# EAGLE design VIC_proto (EAGLE 7.7.0)
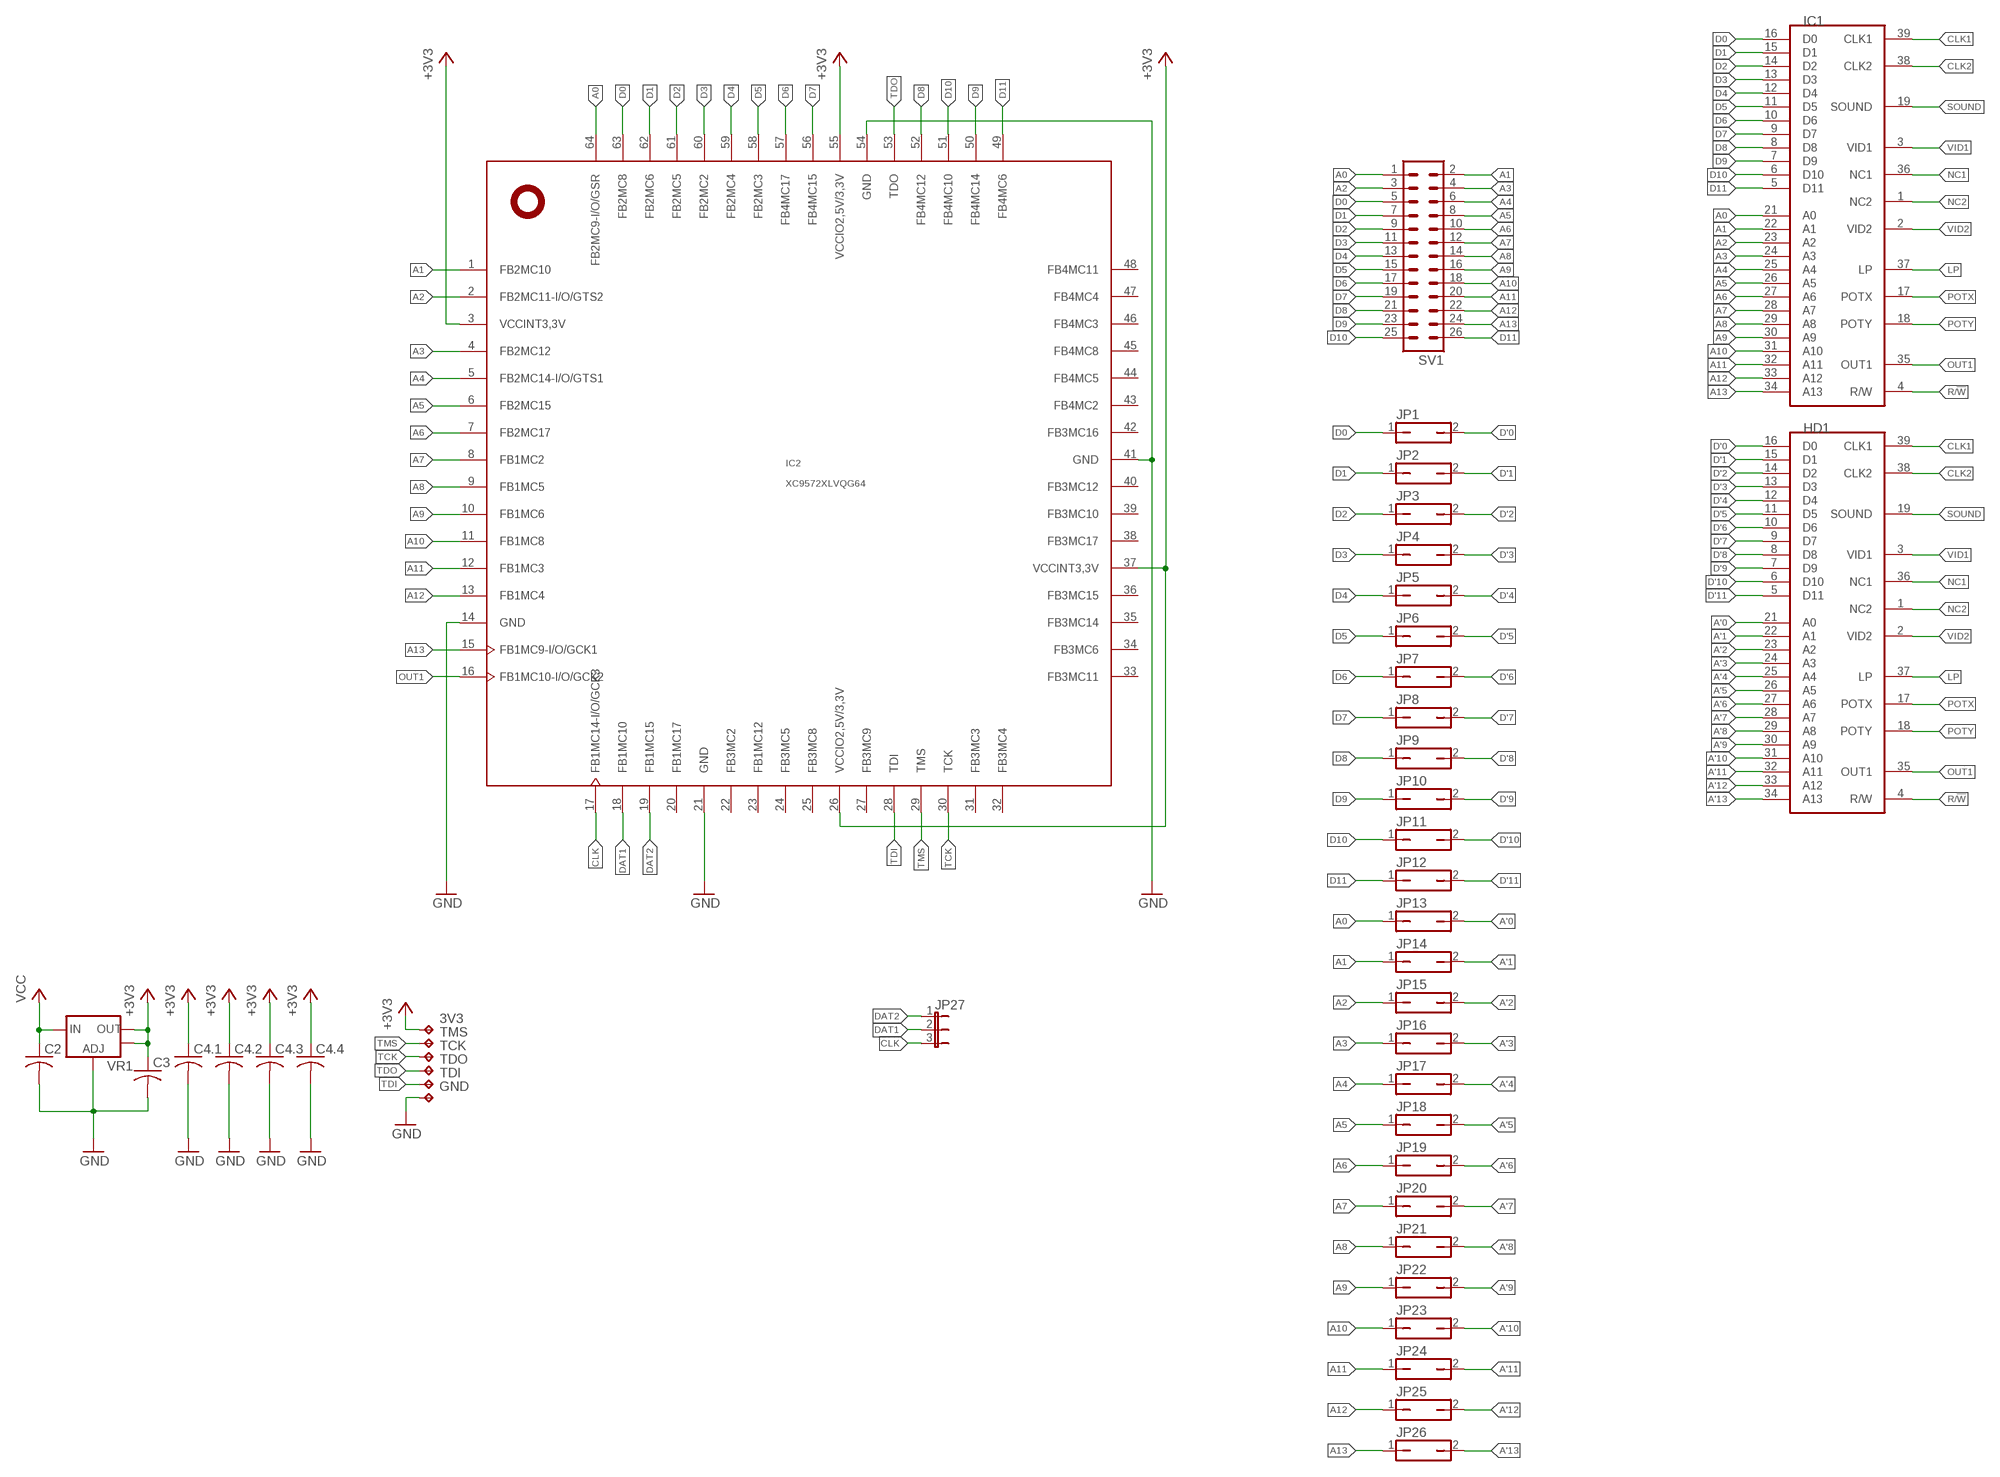
[diagram p0: schematic, sheet 1]

## Parts
3V3  TPTP09R  [TP09R]
C2  C-USC0805  [C0805]
C3  C-USC0805  [C0805]
C4.1  C-USC0402  [C0402]
C4.2  C-USC0402  [C0402]
C4.3  C-USC0402  [C0402]
C4.4  C-USC0402  [C0402]
GND  TPTP10R  [TP10R]
HD1  6560-RP  [DIL40-ROUNDPAD]
IC1  6560-RP  [DIL40-ROUNDPAD]
IC2  XC9572XLVQG64  [VQFP64]
JP1  JP1Q  [JP1]
JP2  JP1Q  [JP1]
JP3  JP1Q  [JP1]
JP4  JP1Q  [JP1]
JP5  JP1Q  [JP1]
JP6  JP1Q  [JP1]
JP7  JP1Q  [JP1]
JP8  JP1Q  [JP1]
JP9  JP1Q  [JP1]
JP10  JP1Q  [JP1]
JP11  JP1Q  [JP1]
JP12  JP1Q  [JP1]
JP13  JP1Q  [JP1]
JP14  JP1Q  [JP1]
JP15  JP1Q  [JP1]
JP16  JP1Q  [JP1]
JP17  JP1Q  [JP1]
JP18  JP1Q  [JP1]
JP19  JP1Q  [JP1]
JP20  JP1Q  [JP1]
JP21  JP1Q  [JP1]
JP22  JP1Q  [JP1]
JP23  JP1Q  [JP1]
JP24  JP1Q  [JP1]
JP25  JP1Q  [JP1]
JP26  JP1Q  [JP1]
JP27  JP2E  [JP2]
SV1  MA13-2  [MA13-2]
TCK  TPTP09R  [TP09R]
TDI  TPTP09R  [TP09R]
TDO  TPTP09R  [TP09R]
TMS  TPTP09R  [TP09R]
VR1  V_REG_LM1117SOT223  [SOT223]

## Nets
+3V3: 3V3.TP C3.1 C4.1.1 C4.2.1 C4.3.1 C4.4.1 IC2.3(VCCINT3,3V) IC2.26(VCCIO2,5V/3,3V) IC2.37(VCCINT3,3V) IC2.55(VCCIO2,5V/3,3V) VR1.2(OUT) VR1.4(OUT)
A0: IC1.21(A0) IC2.64(FB2MC9-I/O/GSR) JP13.1 SV1.1
A1: IC1.22(A1) IC2.1(FB2MC10) JP14.1 SV1.2
A2: IC1.23(A2) IC2.2(FB2MC11-I/O/GTS2) JP15.1 SV1.3
A3: IC1.24(A3) IC2.4(FB2MC12) JP16.1 SV1.4
A4: IC1.25(A4) IC2.5(FB2MC14-I/O/GTS1) JP17.1 SV1.6
A5: IC1.26(A5) IC2.6(FB2MC15) JP18.1 SV1.8
A6: IC1.27(A6) IC2.7(FB2MC17) JP19.1 SV1.10
A7: IC1.28(A7) IC2.8(FB1MC2) JP20.1 SV1.12
A8: IC1.29(A8) IC2.9(FB1MC5) JP21.1 SV1.14
A9: IC1.30(A9) IC2.10(FB1MC6) JP22.1 SV1.16
A10: IC1.31(A10) IC2.11(FB1MC8) JP23.1 SV1.18
A11: IC1.32(A11) IC2.12(FB1MC3) JP24.1 SV1.20
A12: IC1.33(A12) IC2.13(FB1MC4) JP25.1 SV1.22
A13: IC1.34(A13) IC2.15(FB1MC9-I/O/GCK1) JP26.1 SV1.24
A'0: HD1.21(A0) JP13.2
A'1: HD1.22(A1) JP14.2
A'2: HD1.23(A2) JP15.2
A'3: HD1.24(A3) JP16.2
A'4: HD1.25(A4) JP17.2
A'5: HD1.26(A5) JP18.2
A'6: HD1.27(A6) JP19.2
A'7: HD1.28(A7) JP20.2
A'8: HD1.29(A8) JP21.2
A'9: HD1.30(A9) JP22.2
A'10: HD1.31(A10) JP23.2
A'11: HD1.32(A11) JP24.2
A'12: HD1.33(A12) JP25.2
A'13: HD1.34(A13) JP26.2
CLK: IC2.17(FB1MC14-I/O/GCK3) JP27.3
CLK1: HD1.39(CLK1) IC1.39(CLK1)
CLK2: HD1.38(CLK2) IC1.38(CLK2)
D0: IC1.16(D0) IC2.63(FB2MC8) JP1.1 SV1.5
D1: IC1.15(D1) IC2.62(FB2MC6) JP2.1 SV1.7
D2: IC1.14(D2) IC2.61(FB2MC5) JP3.1 SV1.9
D3: IC1.13(D3) IC2.60(FB2MC2) JP4.1 SV1.11
D4: IC1.12(D4) IC2.59(FB2MC4) JP5.1 SV1.13
D5: IC1.11(D5) IC2.58(FB2MC3) JP6.1 SV1.15
D6: IC1.10(D6) IC2.57(FB4MC17) JP7.1 SV1.17
D7: IC1.9(D7) IC2.56(FB4MC15) JP8.1 SV1.19
D8: IC1.8(D8) IC2.52(FB4MC12) JP9.1 SV1.21
D9: IC1.7(D9) IC2.50(FB4MC14) JP10.1 SV1.23
D10: IC1.6(D10) IC2.51(FB4MC10) JP11.1 SV1.25
D11: IC1.5(D11) IC2.49(FB4MC6) JP12.1 SV1.26
D'0: HD1.16(D0) JP1.2
D'1: HD1.15(D1) JP2.2
D'2: HD1.14(D2) JP3.2
D'3: HD1.13(D3) JP4.2
D'4: HD1.12(D4) JP5.2
D'5: HD1.11(D5) JP6.2
D'6: HD1.10(D6) JP7.2
D'7: HD1.9(D7) JP8.2
D'8: HD1.8(D8) JP9.2
D'9: HD1.7(D9) JP10.2
D'10: HD1.6(D10) JP11.2
D'11: HD1.5(D11) JP12.2
DAT1: IC2.18(FB1MC10) JP27.2
DAT2: IC2.19(FB1MC15) JP27.1
GND: C2.2 C3.2 C4.1.2 C4.2.2 C4.3.2 C4.4.2 GND.TP IC2.14(GND) IC2.21(GND) IC2.41(GND) IC2.54(GND) VR1.1(ADJ)
LP: HD1.37(LP) IC1.37(LP)
NC1: HD1.36(NC1) IC1.36(NC1)
NC2: HD1.1(NC2) IC1.1(NC2)
OUT1: HD1.35(OUT1) IC1.35(OUT1) IC2.16(FB1MC10-I/O/GCK2)
POTX: HD1.17(POTX) IC1.17(POTX)
POTY: HD1.18(POTY) IC1.18(POTY)
R/!W: HD1.4(R/W) IC1.4(R/W)
SOUND: HD1.19(SOUND) IC1.19(SOUND)
TCK: IC2.30(TCK) TCK.TP
TDI: IC2.28(TDI) TDI.TP
TDO: IC2.53(TDO) TDO.TP
TMS: IC2.29(TMS) TMS.TP
VCC: C2.1 VR1.3(IN)
VID1: HD1.3(VID1) IC1.3(VID1)
VID2: HD1.2(VID2) IC1.2(VID2)
Unconnected: IC2.20(FB1MC17) IC2.22(FB3MC2) IC2.23(FB1MC12) IC2.24(FB3MC5) IC2.25(FB3MC8) IC2.27(FB3MC9) IC2.31(FB3MC3) IC2.32(FB3MC4) IC2.33(FB3MC11) IC2.34(FB3MC6) IC2.35(FB3MC14) IC2.36(FB3MC15) IC2.38(FB3MC17) IC2.39(FB3MC10) IC2.40(FB3MC12) IC2.42(FB3MC16) IC2.43(FB4MC2) IC2.44(FB4MC5) IC2.45(FB4MC8) IC2.46(FB4MC3) IC2.47(FB4MC4) IC2.48(FB4MC11)

## Power pins joined to a net without a drawn wire
GND: HD1.20(GND) IC1.20(GND)
VCC: HD1.40(VCC) IC1.40(VCC)

## Library data of the parts
3V3 GND TCK TDI TDO TMS = testpad:TP: Test pad
C2 C3 C4.1-C4.4 = rcl:C-US: CAPACITOR, American symbol
HD1 IC1 = commodore:6560: Video IC, NTSC-version, used in the VIC-20. 6561 PAL version is pin compatible.
IC2 = xilinx_xc95XXXxl:XC9572XLVQG64
JP1-JP26 = jumper-jlb:JP1Q: JUMPER
JP27 = jumper-jlb:JP2E: JUMPER
SV1 = con-lstb-rp:MA13-2: PIN HEADER; OC_FARNELL: unknown; OC_NEWARK: unknown
VR1 = SparkFun:V_REG_LM1117: Voltage Regulator LM1117 Standard adjustable voltage regulator but in SMD form. Spark Fun Electronics SKU : COM-00595

## Board
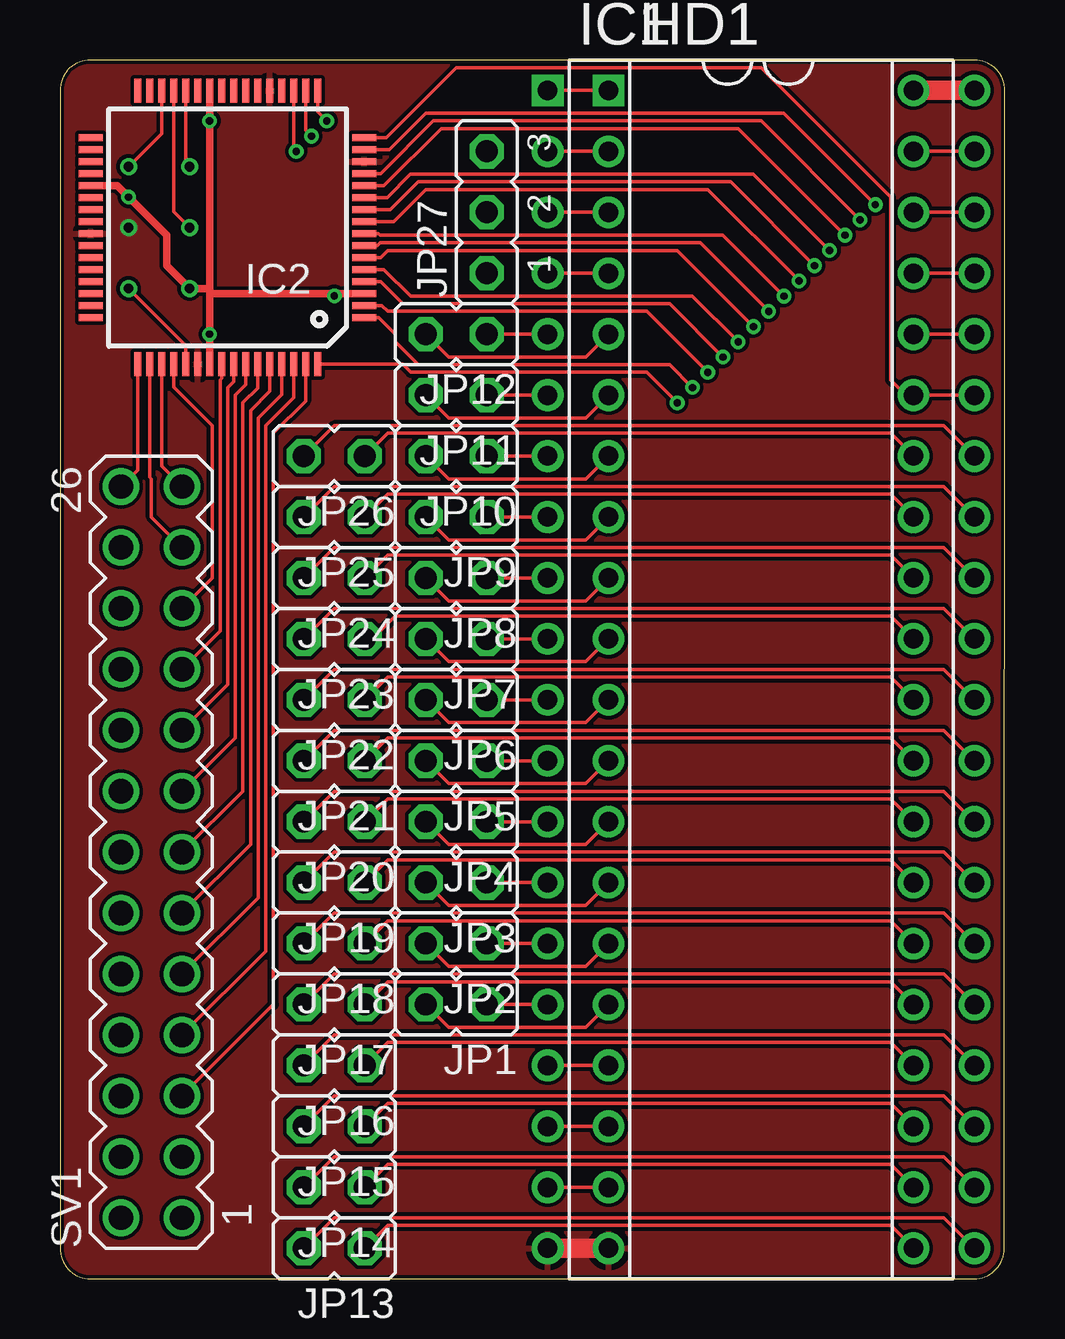
[diagram p1: board, top side]
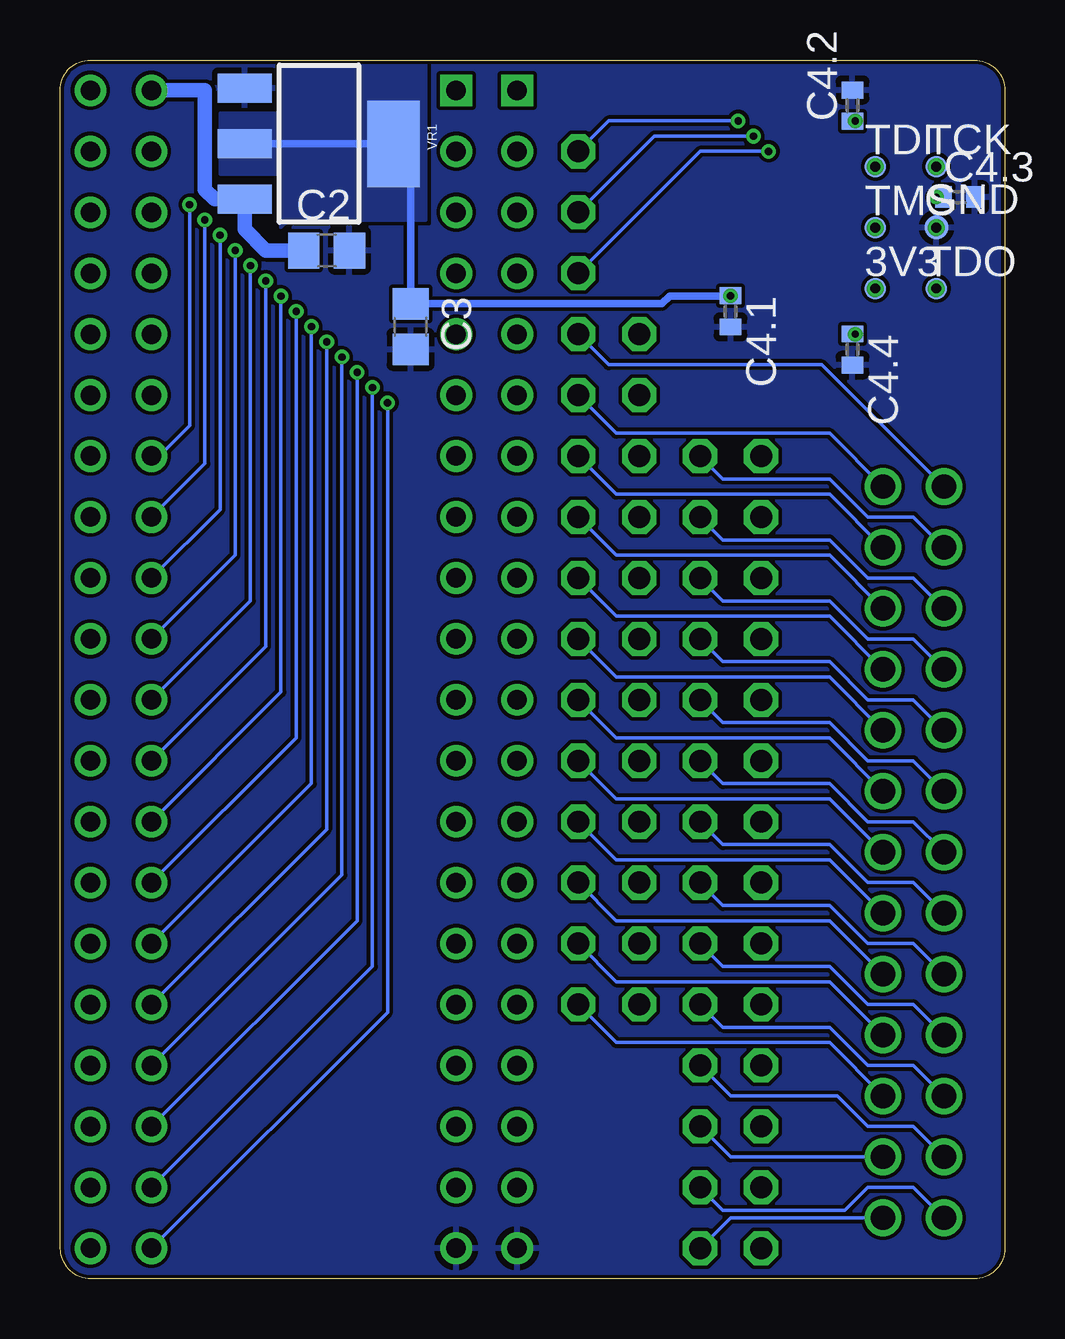
[diagram p2: board, bottom side, seen from below]

Size 39.37 x 50.8 mm. Coordinates in mm from the lower left corner, seen from the top.
Outline: 0,49.53 0,1.27 arc90 1.27,0 38.08,0 arc90 39.35,1.27 39.37,49.53 arc90 38.1,50.8 1.27,50.8 arc90 0,49.53
Copper layers (1*16): Top 0.035mm / dielectric 1.5mm / Bottom 0.035mm
Design rules "hackvana *": minimum track width 6mil, minimum drill 0.3mm, track to track 6mil, track to pad 6mil, pad to pad 6mil, via to via 6mil, smd to smd 0mil, copper to edge 6mil, drill to drill 6mil, minimum pad ring 10mil, minimum via ring 6mil, stop-mask expansion 2mil, vias tented up to drill 100mil, thermal gap 10mil

### Footprints (pad centres in the part's own frame; a part is rotated, then mirrored left to right if it is on the bottom)
TP09R = smd 0.9 x 0.9: TP 0,0
C0805 = smd 1.3 x 1.5: 1 -0.95,0; 2 0.95,0
C0402 = smd 0.7 x 0.9: 1 -0.65,0; 2 0.65,0
TP10R = smd 1 x 1: TP 0,0
DIL40-ROUNDPAD = drill 0.813 square: 1 -24.13,-7.62 | drill 0.813: 2 -21.59,-7.62; 3 -19.05,-7.62; 4 -16.51,-7.62; 5 -13.97,-7.62; 6 -11.43,-7.62; 7 -8.89,-7.62; 8 -6.35,-7.62; 9 -3.81,-7.62; 10 -1.27,-7.62; 11 1.27,-7.62; 12 3.81,-7.62; 13 6.35,-7.62; 14 8.89,-7.62; 15 11.43,-7.62; 16 13.97,-7.62; 17 16.51,-7.62; 18 19.05,-7.62; 19 21.59,-7.62; 20 24.13,-7.62; 21 24.13,7.62; 22 21.59,7.62; 23 19.05,7.62; 24 16.51,7.62; 25 13.97,7.62; 26 11.43,7.62; 27 8.89,7.62; 28 6.35,7.62; 29 3.81,7.62; 30 1.27,7.62; 31 -1.27,7.62; 32 -3.81,7.62; 33 -6.35,7.62; 34 -8.89,7.62; 35 -11.43,7.62; 36 -13.97,7.62; 37 -16.51,7.62; 38 -19.05,7.62; 39 -21.59,7.62; 40 -24.13,7.62
VQFP64 = smd 1 x 0.3: 1 -5.7,3.75; 2 -5.7,3.25; 3 -5.7,2.75; 4 -5.7,2.25; 5 -5.7,1.75; 6 -5.7,1.25; 7 -5.7,0.75; 8 -5.7,0.25; 9 -5.7,-0.25; 10 -5.7,-0.75; 11 -5.7,-1.25; 12 -5.7,-1.75; 13 -5.7,-2.25; 14 -5.7,-2.75; 15 -5.7,-3.25; 16 -5.7,-3.75; 33 5.7,-3.75; 34 5.7,-3.25; 35 5.7,-2.75; 36 5.7,-2.25; 37 5.7,-1.75; 38 5.7,-1.25; 39 5.7,-0.75; 40 5.7,-0.25; 41 5.7,0.25; 42 5.7,0.75; 43 5.7,1.25; 44 5.7,1.75; 45 5.7,2.25; 46 5.7,2.75; 47 5.7,3.25; 48 5.7,3.75 | smd 0.3 x 1: 17 -3.75,-5.7; 18 -3.25,-5.7; 19 -2.75,-5.7; 20 -2.25,-5.7; 21 -1.75,-5.7; 22 -1.25,-5.7; 23 -0.75,-5.7; 24 -0.25,-5.7; 25 0.25,-5.7; 26 0.75,-5.7; 27 1.25,-5.7; 28 1.75,-5.7; 29 2.25,-5.7; 30 2.75,-5.7; 31 3.25,-5.7; 32 3.75,-5.7; 49 3.75,5.7; 50 3.25,5.7; 51 2.75,5.7; 52 2.25,5.7; 53 1.75,5.7; 54 1.25,5.7; 55 0.75,5.7; 56 0.25,5.7; 57 -0.25,5.7; 58 -0.75,5.7; 59 -1.25,5.7; 60 -1.75,5.7; 61 -2.25,5.7; 62 -2.75,5.7; 63 -3.25,5.7; 64 -3.75,5.7
JP1 = drill 0.914 octagon: 1 0,-1.27; 2 0,1.27
JP2 = drill 0.914 octagon: 1 -2.54,0; 2 0,0; 3 2.54,0
MA13-2 = drill 1.016: 1 -15.24,-1.27; 2 -15.24,1.27; 3 -12.7,-1.27; 4 -12.7,1.27; 5 -10.16,-1.27; 6 -10.16,1.27; 7 -7.62,-1.27; 8 -7.62,1.27; 9 -5.08,-1.27; 10 -5.08,1.27; 11 -2.54,-1.27; 12 -2.54,1.27; 13 0,-1.27; 14 0,1.27; 15 2.54,-1.27; 16 2.54,1.27; 17 5.08,-1.27; 18 5.08,1.27; 19 7.62,-1.27; 20 7.62,1.27; 21 10.16,-1.27; 22 10.16,1.27; 23 12.7,-1.27; 24 12.7,1.27; 25 15.24,-1.27; 26 15.24,1.27
SOT223 = smd 1.219 x 2.235: 1 -2.311,-3.099; 2 0,-3.099; 3 2.311,-3.099 | smd 3.6 x 2.2: 4 0,3.099

### Placement (x,y rotation side)
3V3  5.4,41.27 0 bottom
C2  28.26,42.86 0 bottom
C3  24.77,39.69 270 bottom
C4.1  11.43,40.32 270 bottom
C4.2  6.35,48.9 90 bottom
C4.3  1.91,45.09 0 bottom
C4.4  6.35,38.73 270 bottom
GND  2.86,43.81 0 bottom
HD1  30.48,25.4 270 top
IC1  27.94,25.4 270 top
IC2  6.99,43.81 180 top
JP1  16.51,11.43 90 top
JP2  16.51,13.97 90 top
JP3  16.51,16.51 90 top
JP4  16.51,19.05 90 top
JP5  16.51,21.59 90 top
JP6  16.51,24.13 90 top
JP7  16.51,26.67 90 top
JP8  16.51,29.21 90 top
JP9  16.51,31.75 90 top
JP10  16.51,34.29 90 top
JP11  16.51,36.83 90 top
JP12  16.51,39.37 90 top
JP13  11.43,1.27 90 top
JP14  11.43,3.81 90 top
JP15  11.43,6.35 90 top
JP16  11.43,8.89 90 top
JP17  11.43,11.43 90 top
JP18  11.43,13.97 90 top
JP19  11.43,16.51 90 top
JP20  11.43,19.05 90 top
JP21  11.43,21.59 90 top
JP22  11.43,24.13 90 top
JP23  11.43,26.67 90 top
JP24  11.43,29.21 90 top
JP25  11.43,31.75 90 top
JP26  11.43,34.29 90 top
JP27  17.78,44.45 90 top
SV1  3.81,17.78 90 top
TCK  2.86,46.35 0 bottom
TDI  5.4,46.35 0 bottom
TDO  2.86,41.27 0 bottom
TMS  5.4,43.81 0 bottom
VR1  28.57,47.31 270 bottom

### Tracks (layer width: path | path; a pad name or v marks a point on that pad's centre or on a via)
+3V3  (via drill 0.3, 0.41)
  Top 0.305: IC2.55 v6.24,39.37 6.24,41.06 | IC2.26 v6.24,48.26 6.24,41.27 | 6.24,41.27 3V3.TP 4.45,42.23 4.45,43.5 v2.86,45.09 2.38,45.56 IC2.37 | IC2.3 11.43,41.06 | 11.43,41.06 6.24,41.06 | 6.24,41.06 6.24,41.27 | C4.1.1 11.43,41.06
  Bottom 0.305: 11.43,40.96 C4.1.1 11.45,40.96 13.97,40.96 14.29,40.64 C3.1 | C4.3.1 v2.86,45.09 | C4.2.1 6.25,48.24 v6.24,48.26 | VR1.2 VR1.4 24.76,46.59 C3.1 | C4.4.1 6.24,39.38 v6.24,39.37 | C3.1
  other vias: 5.4,41.27 11.43,40.97
  pour Bottom (no thermals): 24.13,50.8 30.16,50.8 30.16,48.58 32.7,48.58 32.7,46.04 30.16,46.04 30.16,43.81 29.84,44.13 24.13,44.13
A0  (via drill 0.3)
  Top 0.152: JP13.1 13.65,2.22 34.61,2.22 IC1.21 | v25.72,36.51 24.45,37.78 14.61,37.78 14.27,38.12 IC2.64
  Bottom 0.152: JP13.1 11.43,2.54 SV1.1 | IC1.21 25.72,11.11 v25.72,36.51
A1  (via drill 0.3)
  Top 0.152: IC1.22 34.61,4.76 13.65,4.76 JP14.1 | v26.35,37.15 25.4,38.1 14.92,38.1 13.97,39.05 13.97,39.37 13.28,40.06 IC2.1
  Bottom 0.152: JP14.1 11.75,2.86 6.67,2.86 5.71,3.81 3.81,3.81 SV1.2 | IC1.22 26.35,13.02 v26.35,37.15
A2  (via drill 0.3)
  Top 0.152: JP15.1 13.65,7.3 34.61,7.3 IC1.23 | v26.99,37.78 24.45,40.32 13.65,40.32 13.41,40.56 IC2.2
  Bottom 0.152: SV1.3 11.43,5.08 JP15.1 | IC1.23 26.99,14.92 v26.99,37.78
A3  (via drill 0.3)
  Top 0.152: JP16.1 13.65,9.84 34.61,9.84 IC1.24 | v27.62,38.42 25.4,40.64 14.29,40.64 13.36,41.56 IC2.4
  Bottom 0.152: JP16.1 11.43,7.62 6.99,7.62 5.71,6.35 3.81,6.35 SV1.4 | IC1.24 27.62,16.83 v27.62,38.42
A4  (via drill 0.3)
  Top 0.152: JP17.1 13.65,12.38 34.61,12.38 IC1.25 | v28.26,39.05 26.35,40.96 14.61,40.96 13.5,42.06 IC2.5
  Bottom 0.152: JP17.1 11.75,10.48 7.3,10.48 5.71,8.89 3.81,8.89 SV1.6 | IC1.25 28.26,18.73 v28.26,39.05
A5  (via drill 0.3)
  Top 0.152: JP18.1 13.65,14.92 34.61,14.92 IC1.26 | v28.89,39.69 25.72,42.86 13.65,42.86 13.36,42.56 IC2.6
  Bottom 0.152: JP18.1 11.75,13.02 7.3,13.02 5.71,11.43 3.81,11.43 SV1.8 | IC1.26 28.89,20.64 v28.89,39.69
A6  (via drill 0.3)
  Top 0.152: JP19.1 13.65,17.46 34.61,17.46 IC1.27 | v29.53,40.32 26.67,43.18 13.34,43.18 13.22,43.06 IC2.7
  Bottom 0.152: SV1.10 3.81,13.97 5.71,13.97 7.3,15.56 11.75,15.56 JP19.1 | IC1.27 29.53,22.54 v29.53,40.32
A7  (via drill 0.3)
  Top 0.152: JP20.1 13.65,20 34.61,20 IC1.28 | v30.16,40.96 27.62,43.5 13.34,43.5 13.27,43.56 IC2.8
  Bottom 0.152: SV1.12 3.81,16.51 5.71,16.51 7.3,18.1 11.75,18.1 JP20.1 | IC1.28 30.16,24.45 v30.16,40.96
A8  (via drill 0.3)
  Top 0.152: JP21.1 13.65,22.54 34.61,22.54 IC1.29 | v30.8,41.59 26.99,45.4 15.24,45.4 13.9,44.06 IC2.9
  Bottom 0.152: SV1.14 3.81,19.05 5.71,19.05 7.3,20.64 11.75,20.64 JP21.1 | IC1.29 30.8,26.35 v30.8,41.59
A9  (via drill 0.3)
  Top 0.152: JP22.1 13.65,25.08 34.61,25.08 IC1.30 | v31.43,42.23 27.94,45.72 14.92,45.72 13.77,44.56 IC2.10
  Bottom 0.152: SV1.16 3.81,21.59 5.71,21.59 7.3,23.18 11.75,23.18 JP22.1 | IC1.30 31.43,28.26 v31.43,42.23
A10  (via drill 0.3)
  Top 0.152: JP23.1 13.02,26.67 13.97,27.62 34.61,27.62 IC1.31 | v32.07,42.86 28.89,46.04 14.6,46.04 13.62,45.06 IC2.11
  Bottom 0.152: SV1.18 3.81,24.13 5.71,24.13 7.3,25.72 11.75,25.72 JP23.1 | IC1.31 32.07,30.16 v32.07,42.86
A11  (via drill 0.3)
  Top 0.152: JP24.1 13.65,30.16 34.61,30.16 IC1.32 | v32.7,43.5 28.26,47.94 15.88,47.94 13.5,45.56 IC2.12
  Bottom 0.152: SV1.20 3.81,26.67 5.71,26.67 7.3,28.26 11.75,28.26 JP24.1 | IC1.32 32.7,32.07 v32.7,43.5
A12  (via drill 0.3)
  Top 0.152: JP25.1 13.65,32.7 34.61,32.7 IC1.33 | v33.34,44.13 29.21,48.26 15.56,48.26 13.36,46.06 IC2.13
  Bottom 0.152: SV1.22 3.81,29.21 5.71,29.21 7.3,30.8 11.75,30.8 JP25.1 | IC1.33 33.34,33.97 v33.34,44.13
A13  (via drill 0.3)
  Top 0.152: IC1.34 34.61,35.24 13.65,35.24 JP26.1 | v33.97,44.77 30.16,48.58 15.24,48.58 13.73,47.06 IC2.15
  Bottom 0.152: SV1.24 3.81,31.75 5.71,31.75 7.3,33.34 11.75,33.34 JP26.1 | IC1.34 35.24,34.29 33.97,35.56 v33.97,44.77
A'0
  Top 0.152: HD1.21 36.83,2.54 11.43,2.54 JP13.2
A'1
  Top 0.152: HD1.22 36.83,5.08 11.43,5.08 JP14.2
A'2
  Top 0.152: HD1.23 36.83,7.62 11.43,7.62 JP15.2
A'3
  Top 0.152: HD1.24 36.83,10.16 11.43,10.16 JP16.2
A'4
  Top 0.152: HD1.25 36.83,12.7 11.43,12.7 JP17.2
A'5
  Top 0.152: HD1.26 36.83,15.24 11.43,15.24 JP18.2
A'6
  Top 0.152: HD1.27 36.83,17.78 11.43,17.78 JP19.2
A'7
  Top 0.152: HD1.28 36.83,20.32 11.43,20.32 JP20.2
A'8
  Top 0.152: HD1.29 36.83,22.86 11.43,22.86 JP21.2
A'9
  Top 0.152: HD1.30 36.83,25.4 11.43,25.4 JP22.2
A'10
  Top 0.152: HD1.31 36.83,27.94 11.43,27.94 JP23.2
A'11
  Top 0.152: HD1.32 36.83,30.48 11.43,30.48 JP24.2
A'12
  Top 0.152: HD1.33 36.83,33.02 11.43,33.02 JP25.2
A'13
  Top 0.152: HD1.34 36.83,35.56 11.43,35.56 JP26.2
CLK  (via drill 0.3)
  Top 0.152: IC2.17 10.73,48.64 v11.11,48.26
  Bottom 0.152: v11.11,48.26 16.51,48.26 JP27.3
CLK1
  Top 0.152: HD1.39 IC1.39
CLK2
  Top 0.152: HD1.38 IC1.38
D0
  Top 0.152: JP1.1 IC1.16 | SV1.5 8.89,11.43 8.89,35.24 10.23,36.59 IC2.63
  Bottom 0.152: JP1.1 16.19,9.84 7.3,9.84 SV1.5
D1
  Top 0.152: JP2.1 IC1.15 | SV1.7 8.57,13.65 8.57,35.56 9.73,36.72 IC2.62
  Bottom 0.152: JP2.1 16.19,12.38 7.3,12.38 SV1.7
D2
  Top 0.152: JP3.1 IC1.14 | SV1.9 8.26,15.88 8.26,35.88 9.23,36.86 IC2.61
  Bottom 0.152: SV1.9 7.3,14.92 16.19,14.92 JP3.1
D3
  Top 0.152: JP4.1 IC1.13 | SV1.11 7.94,18.1 7.94,36.2 8.73,36.99 IC2.60
  Bottom 0.152: SV1.11 7.3,17.46 16.19,17.46 JP4.1
D4
  Top 0.152: JP5.1 IC1.12 | SV1.13 7.62,20.32 7.62,36.51 8.23,37.13 IC2.59
  Bottom 0.152: SV1.13 7.3,20 16.19,20 JP5.1
D5
  Top 0.152: JP6.1 IC1.11 | SV1.15 7.3,22.54 7.3,36.83 7.74,37.26 IC2.58
  Bottom 0.152: SV1.15 7.3,22.54 16.19,22.54 JP6.1
D6
  Top 0.152: IC1.10 JP7.1 | SV1.17 6.99,24.77 6.99,37.15 7.24,37.4 IC2.57
  Bottom 0.152: SV1.17 7.3,25.08 16.19,25.08 JP7.1
D7
  Top 0.152: IC1.9 JP8.1 | SV1.19 6.67,26.99 6.67,37.47 6.74,37.53 IC2.56
  Bottom 0.152: SV1.19 7.3,27.62 16.19,27.62 JP8.1
D8
  Top 0.152: IC1.8 JP9.1 | SV1.21 6.35,29.21 6.35,35.56 4.74,37.17 IC2.52
  Bottom 0.152: SV1.21 7.3,30.16 16.19,30.16 JP9.1
D9
  Top 0.152: IC1.7 JP10.1 | SV1.23 3.81,31.75 3.81,33.34 3.73,33.41 IC2.50
  Bottom 0.152: SV1.23 7.3,32.7 16.19,32.7 JP10.1
D10
  Top 0.152: IC1.6 JP11.1 | IC2.51 4.24,33.87 SV1.25
  Bottom 0.152: SV1.25 7.3,35.24 16.19,35.24 JP11.1
D11
  Top 0.152: IC1.5 JP12.1 | IC2.49 3.23,33.72 SV1.26
  Bottom 0.152: SV1.26 7.62,38.1 16.51,38.1 JP12.1 18.41,39.37
D'0
  Top 0.152: JP1.2 16.19,10.48 21.91,10.48 HD1.16
D'1
  Top 0.152: JP2.2 16.19,13.02 21.91,13.02 HD1.15
D'2
  Top 0.152: JP3.2 16.19,15.56 21.91,15.56 HD1.14
D'3
  Top 0.152: JP4.2 16.19,18.1 21.91,18.1 HD1.13
D'4
  Top 0.152: JP5.2 16.19,20.64 21.91,20.64 HD1.12
D'5
  Top 0.152: JP6.2 16.19,23.18 21.91,23.18 HD1.11
D'6
  Top 0.152: JP7.2 16.19,25.72 21.91,25.72 HD1.10
D'7
  Top 0.152: JP8.2 16.19,28.26 21.91,28.26 HD1.9
D'8
  Top 0.152: JP9.2 16.19,30.8 21.91,30.8 HD1.8
D'9
  Top 0.152: JP10.2 16.19,33.34 21.91,33.34 HD1.7
D'10
  Top 0.152: HD1.6 21.91,35.88 16.19,35.88 JP11.2
D'11
  Top 0.152: HD1.5 21.91,38.42 16.19,38.42 JP12.2
DAT1  (via drill 0.3)
  Top 0.152: IC2.18 10.23,47.87 v10.48,47.62
  Bottom 0.152: v10.48,47.62 14.61,47.62 JP27.2
DAT2  (via drill 0.3)
  Top 0.152: IC2.19 9.73,47.1 v9.84,46.99
  Bottom 0.152: v9.84,46.99 12.7,46.99 JP27.1
GND  (via drill 0.41)
  Top 0.813: IC1.20 HD1.20
  other vias: 2.86,43.81
  pour Top (rank 2): 38.1,0 1.27,0 arc-90 0,1.27 0,49.53 arc-90 1.27,50.8 38.1,50.8 arc-90 39.37,49.53 39.37,1.27 arc-90
  pour Bottom (rank 2): 38.1,0 1.27,0 arc-90 0,1.27 0,49.53 arc-90 1.27,50.8 38.1,50.8 arc-90 39.37,49.53 39.37,1.27 arc-90
LP
  Top 0.152: HD1.37 IC1.37
NC1
  Top 0.152: HD1.36 IC1.36
NC2
  Top 0.152: IC1.1 HD1.1
OUT1
  Top 0.152: HD1.35 IC1.35 35.24,36.83 34.61,37.47 34.61,45.09 29.21,50.48 16.51,50.48 13.59,47.56 IC2.16
POTX
  Top 0.152: IC1.17 HD1.17
POTY
  Top 0.152: IC1.18 HD1.18
R/!W
  Top 0.152: IC1.4 HD1.4
SOUND
  Top 0.152: IC1.19 HD1.19
TCK  (via drill 0.41)
  Top 0.152: IC2.30 4.24,47.73 TCK.TP
  other vias: 2.86,46.35
TDI  (via drill 0.41)
  Top 0.152: IC2.28 5.24,46.52 TDI.TP
  other vias: 5.4,46.35
TDO  (via drill 0.41)
  Top 0.152: IC2.53 5.24,38.9 TDO.TP
  other vias: 2.86,41.27
TMS  (via drill 0.41)
  Top 0.152: IC2.29 4.74,44.48 TMS.TP
  other vias: 5.4,43.81
VCC
  Top 0.813: HD1.40 IC1.40
  Bottom 0.61: IC1.40 33.34,49.53 33.34,45.4 32.93,45 VR1.3 31.67,43.74 30.8,42.86 C2.1
VID1
  Top 0.152: IC1.3 HD1.3
VID2
  Top 0.152: IC1.2 HD1.2